# EAGLE design meca_2013.2 (EAGLE 6.4)
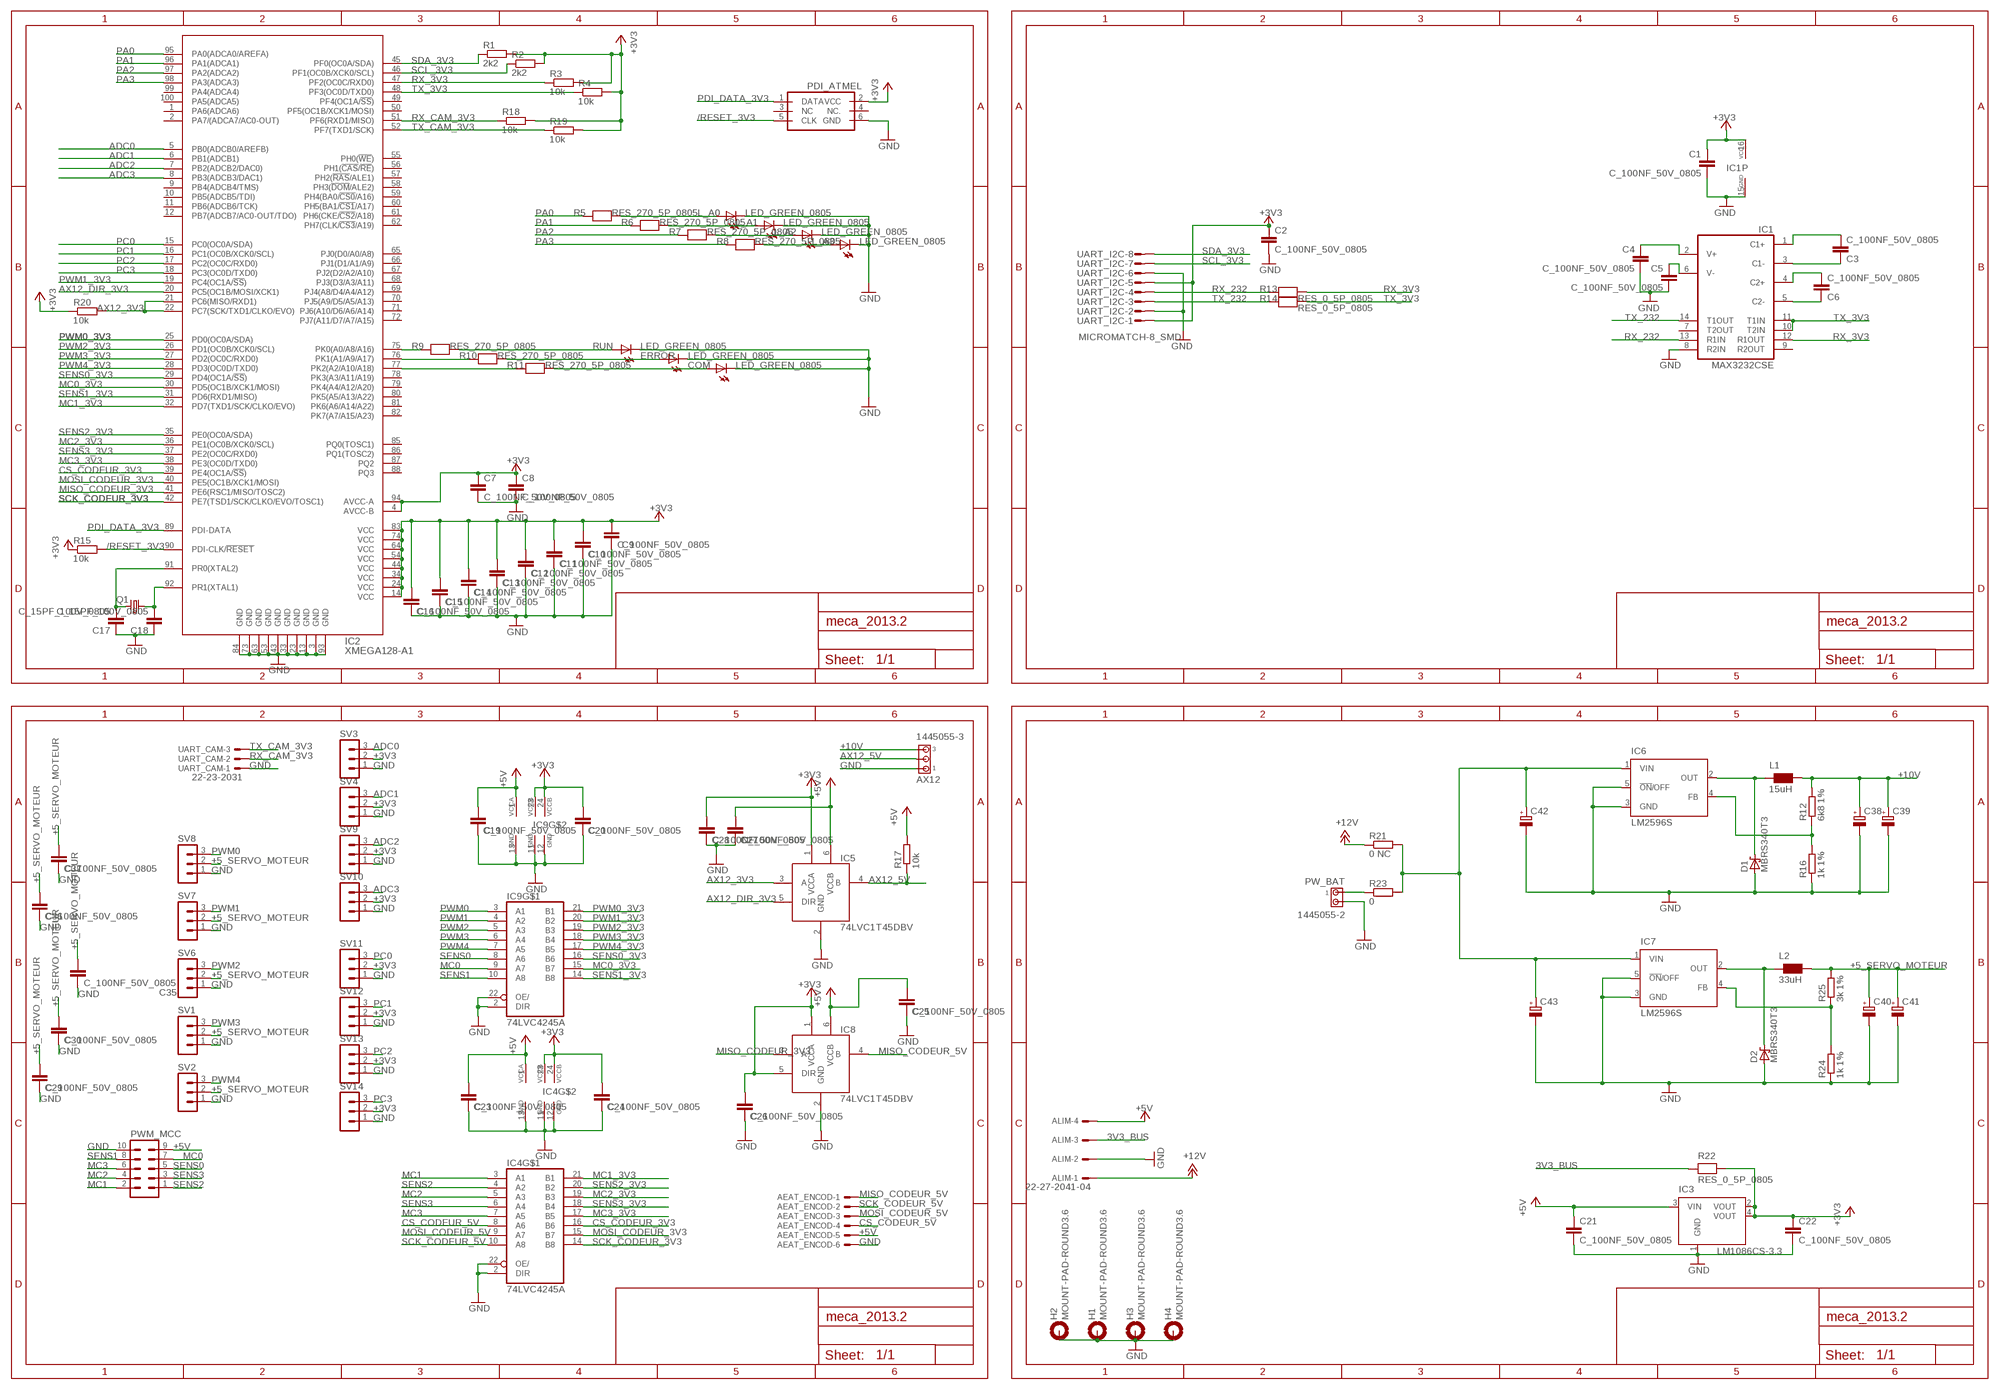
[diagram p0: schematic, sheet 1]

## Parts
AEAT_ENCOD  22-23-2061  [22-23-2061]
ALIM  22-27-2041-04  [6410-04]
AX12  1445055-3  [1445055-3]
C1  C_100NF_50V_0805  [C0805]
C2  C_100NF_50V_0805  [C0805]
C3  C_100NF_50V_0805  [C0805]
C4  C_100NF_50V_0805  [C0805]
C5  C_100NF_50V_0805  [C0805]
C6  C_100NF_50V_0805  [C0805]
C7  C_100NF_50V_0805  [C0805]
C8  C_100NF_50V_0805  [C0805]
C9  C_100NF_50V_0805  [C0805]
C10  C_100NF_50V_0805  [C0805]
C11  C_100NF_50V_0805  [C0805]
C12  C_100NF_50V_0805  [C0805]
C13  C_100NF_50V_0805  [C0805]
C14  C_100NF_50V_0805  [C0805]
C15  C_100NF_50V_0805  [C0805]
C16  C_100NF_50V_0805  [C0805]
C17  C_15PF_100V_0805  [C0805]
C18  C_15PF_100V_0805  [C0805]
C19  C_100NF_50V_0805  [C0805]
C20  C_100NF_50V_0805  [C0805]
C21  C_100NF_50V_0805  [C0805]
C22  C_100NF_50V_0805  [C0805]
C23  C_100NF_50V_0805  [C0805]
C24  C_100NF_50V_0805  [C0805]
C25  C_100NF_50V_0805  [C0805]
C26  C_100NF_50V_0805  [C0805]
C27  C_100NF_50V_0805  [C0805]
C28  C_100NF_50V_0805  [C0805]
C29  C_100NF_50V_0805  [C0805]
C30  C_100NF_50V_0805  [C0805]
C35  C_100NF_50V_0805  [C0805]
C36  C_100NF_50V_0805  [C0805]
C37  C_100NF_50V_0805  [C0805]
C38  CPOL-EUG  [PANASONIC_G]
C39  CPOL-EUG  [PANASONIC_G]
C40  CPOL-EUG  [PANASONIC_G]
C41  CPOL-EUG  [PANASONIC_G]
C42  CPOL-EUG  [PANASONIC_G]
C43  CPOL-EUG  [PANASONIC_G]
COM  LED_GREEN_0805  [CHIP-LED0805]
D1  MBRS340T3  [SMC]
D2  MBRS340T3  [SMC]
ERROR  LED_GREEN_0805  [CHIP-LED0805]
H1  MOUNT-PAD-ROUND3.6  [3,6-PAD]
H2  MOUNT-PAD-ROUND3.6  [3,6-PAD]
H3  MOUNT-PAD-ROUND3.6  [3,6-PAD]
H4  MOUNT-PAD-ROUND3.6  [3,6-PAD]
IC1  MAX3232CSE  [SO16]
IC2  XMEGA128-A1  XMEGA-A1TQFP  [TQFP100]
IC3  LM1086CS-3.3  [TO263]
IC4  74LVC4245A  [TSSOP28]
IC5  74LVC1T45DBV  [SOT23-6]
IC6  LM2596S  [TO263-5]
IC7  LM2596S  [TO263-5]
IC8  74LVC1T45DBV  [SOT23-6]
IC9  74LVC4245A  [TSSOP28]
L1  15uH  WE-PD_L/XL/XXL  [WE-PD_L/XL/XXL]
L2  33uH  WE-PD_L/XL/XXL  [WE-PD_L/XL/XXL]
L_A0  LED_GREEN_0805  [CHIP-LED0805]
L_A1  LED_GREEN_0805  [CHIP-LED0805]
L_A2  LED_GREEN_0805  [CHIP-LED0805]
L_A3  LED_GREEN_0805  [CHIP-LED0805]
PDI_ATMEL  PDI_ATMEL  [ML6]
PW_BAT  1445055-2  [1445055-2]
PWM_MCC  ML10  [ML10]
Q1  CRYSTAL_16MHZ_HC49UP  [HC49UP]
R1  2k2  R-EU_R0603  [R0603]
R2  2k2  R-EU_R0603  [R0603]
R3  10k  R-EU_R0603  [R0603]
R4  10k  R-EU_R0603  [R0603]
R5  RES_270_5P_0805  [R0805]
R6  RES_270_5P_0805  [R0805]
R7  RES_270_5P_0805  [R0805]
R8  RES_270_5P_0805  [R0805]
R9  RES_270_5P_0805  [R0805]
R10  RES_270_5P_0805  [R0805]
R11  RES_270_5P_0805  [R0805]
R12  6k8 1%  R-EU_R0805  [R0805]
R13  RES_0_5P_0805  [R0805]
R14  RES_0_5P_0805  [R0805]
R15  10k  R-EU_R0603  [R0603]
R16  1k 1%  R-EU_R0805  [R0805]
R17  10k  R-EU_R0805  [R0805]
R18  10k  R-EU_R0603  [R0603]
R19  10k  R-EU_R0603  [R0603]
R20  10k  R-EU_R0603  [R0603]
R21  0 NC  R-EU_R0805  [R0805]
R22  RES_0_5P_0805  [R0805]
R23  0  R-EU_R0805  [R0805]
R24  1k 1%  R-EU_R0805  [R0805]
R25  3k 1%  R-EU_R0805  [R0805]
RUN  LED_GREEN_0805  [CHIP-LED0805]
SV1  MA03-1  [MA03-1]
SV2  MA03-1  [MA03-1]
SV3  MA03-1  [MA03-1]
SV4  MA03-1  [MA03-1]
SV6  MA03-1  [MA03-1]
SV7  MA03-1  [MA03-1]
SV8  MA03-1  [MA03-1]
SV9  MA03-1  [MA03-1]
SV10  MA03-1  [MA03-1]
SV11  MA03-1  [MA03-1]
SV12  MA03-1  [MA03-1]
SV13  MA03-1  [MA03-1]
SV14  MA03-1  [MA03-1]
UART_CAM  22-23-2031  [22-23-2031]
UART_I2C  MICROMATCH-8_SMD  [MICROMATCH-8_SMD]

## Nets
3V3_BUS: ALIM.3 R22.1
+3V3: C1.1 C2.1 C7.1 C8.1 C9.1 C10.1 C11.1 C12.1 C13.1 C14.1 C15.1 C16.1 C20.1 C22.1 C24.1 C26.1 C28.1 IC1.16(VCC) IC2.4(AVCC-B) IC2.14(VCC) IC2.24(VCC) IC2.34(VCC) IC2.44(VCC) IC2.54(VCC) IC2.64(VCC) IC2.74(VCC) IC2.83(VCC) IC2.94(AVCC-A) IC3.2(VOUT) IC3.4(VOUT) IC4.23(VCCB) IC4.24(VCCB) IC5.1(VCCA) IC8.1(VCCA) IC8.5(DIR) IC9.23(VCCB) IC9.24(VCCB) PDI_ATMEL.2(VCC) R1.2 R2.2 R3.2 R4.2 R15.1 R18.2 R19.2 R20.1 R22.2 SV3.2 SV4.2 SV9.2 SV10.2 SV11.2 SV12.2 SV13.2 SV14.2 UART_I2C.1 UART_I2C.5
+5_SERVO_MOTEUR: C29.1 C30.1 C35.1 C36.1 C37.1 C40.+ C41.+ L2.1 R25.2 SV1.2 SV2.2 SV6.2 SV7.2 SV8.2
+5V: AEAT_ENCOD.5 ALIM.4 C19.1 C21.1 C23.1 C25.1 C27.1 IC3.3(VIN) IC4.1(VCCA) IC5.6(VCCB) IC8.6(VCCB) IC9.1(VCCA) PWM_MCC.9 R17.2
+10V: AX12.3 C38.+ C39.+ L1.1 R12.2
+12V: ALIM.1 R21.1
/RESET_3V3: IC2.90(PDI-CLK/!RESET) PDI_ATMEL.5(CLK) R15.2
ADC0: IC2.5(PB0(ADCB0/AREFB)) SV3.3
ADC1: IC2.6(PB1(ADCB1)) SV4.3
ADC2: IC2.7(PB2(ADCB2/DAC0)) SV9.3
ADC3: IC2.8(PB3(ADCB3/DAC1)) SV10.3
AX12_3V3: IC2.21(PC6(MISO/RXD1)) IC2.22(PC7(SCK/TXD1/CLKO/EVO)) IC5.3(A) R20.2
AX12_5V: AX12.2 IC5.4(B) R17.1
AX12_DIR_3V3: IC2.20(PC5(OC1B/MOSI/XCK1)) IC5.5(DIR)
CS_CODEUR_3V3: IC2.39(PE4(OC1A/!SS!)) IC4.16(B6)
CS_CODEUR_5V: AEAT_ENCOD.4 IC4.8(A6)
GND: AEAT_ENCOD.6 ALIM.2 AX12.1 C1.2 C2.2 C4.2 C5.2 C7.2 C8.2 C9.2 C10.2 C11.2 C12.2 C13.2 C14.2 C15.2 C16.2 C17.1 C18.1 C19.2 C20.2 C21.2 C22.2 C23.2 C24.2 C25.2 C26.2 C27.2 C28.2 C29.2 C30.2 C35.2 C36.2 C37.2 C38.- C39.- C40.- C41.- C42.- C43.- COM.C D1.A D2.A ERROR.C H1.B3,6(MOUNT) H2.B3,6(MOUNT) H3.B3,6(MOUNT) H4.B3,6(MOUNT) IC1.8(R2IN) IC1.15(GND) IC2.3(GND) IC2.13(GND) IC2.23(GND) IC2.33(GND) IC2.43(GND) IC2.53(GND) IC2.63(GND) IC2.73(GND) IC2.84(GND) IC2.93(GND) IC3.1(GND) IC4.2(DIR) IC4.11(GND) IC4.12(GND) IC4.13(GND) IC4.22(OE/) IC5.2(GND) IC6.3(GND) IC6.5(!ON!/OFF) IC7.3(GND) IC7.5(!ON!/OFF) IC8.2(GND) IC9.2(DIR) IC9.11(GND) IC9.12(GND) IC9.13(GND) IC9.22(OE/) L_A0.C L_A1.C L_A2.C L_A3.C PDI_ATMEL.6(GND) PW_BAT.2 PWM_MCC.10 R16.1 R24.1 RUN.C SV1.1 SV2.1 SV3.1 SV4.1 SV6.1 SV7.1 SV8.1 SV9.1 SV10.1 SV11.1 SV12.1 SV13.1 SV14.1 UART_CAM.1 UART_I2C.2 UART_I2C.6
MC0: IC9.9(A7) PWM_MCC.7
MC0_3V3: IC2.30(PD5(OC1B/XCK1/MOSI)) IC9.15(B7)
MC1: IC4.3(A1) PWM_MCC.2
MC1_3V3: IC2.32(PD7(TXD1/SCK/CLKO/EVO)) IC4.21(B1)
MC2: IC4.5(A3) PWM_MCC.4
MC2_3V3: IC2.36(PE1(OC0B/XCK0/SCL)) IC4.19(B3)
MC3: IC4.7(A5) PWM_MCC.6
MC3_3V3: IC2.38(PE3(OC0D/TXD0)) IC4.17(B5)
MISO_CODEUR_3V3: IC2.41(PE6(RSC1/MISO/TOSC2)) IC8.3(A)
MISO_CODEUR_5V: AEAT_ENCOD.1 IC8.4(B)
MOSI_CODEUR_3V3: IC2.40(PE5(OC1B/XCK1/MOSI)) IC4.15(B7)
MOSI_CODEUR_5V: AEAT_ENCOD.3 IC4.9(A7)
N$1: C3.1 IC1.1(C1+)
N$2: R9.2 RUN.A
N$3: IC7.4(FB) R24.2 R25.1
N$4: ERROR.A R10.2
N$5: C3.2 IC1.3(C1-)
N$6: C6.1 IC1.4(C2+)
N$7: COM.A R11.2
N$8: IC6.4(FB) R12.1 R16.2
N$9: IC2.75(PK0(A0/A8/A16)) R9.1
N$10: IC2.76(PK1(A1/A9/A17)) R10.1
N$11: C4.1 IC1.2(V+)
N$12: IC2.77(PK2(A2/A10/A18)) R11.1
N$13: C5.1 IC1.6(V-)
N$15: PW_BAT.1 R23.1
N$16: D1.C IC6.2(OUT) L1.2
N$17: D2.C IC7.2(OUT) L2.2
N$24: C6.2 IC1.5(C2-)
N$45: C17.2 IC2.91(PR0(XTAL2)) Q1.2
N$46: C18.2 IC2.92(PR1(XTAL1)) Q1.1
N$91: L_A0.A R5.2
N$92: L_A1.A R6.2
N$93: L_A2.A R7.2
N$94: L_A3.A R8.2
PA0: IC2.95(PA0(ADCA0/AREFA)) R5.1
PA1: IC2.96(PA1(ADCA1)) R6.1
PA2: IC2.97(PA2(ADCA2)) R7.1
PA3: IC2.98(PA3(ADCA3)) R8.1
PC0: IC2.15(PC0(OC0A/SDA)) SV11.3
PC1: IC2.16(PC1(OC0B/XCK0/SCL)) SV12.3
PC2: IC2.17(PC2(OC0C/RXD0)) SV13.3
PC3: IC2.18(PC3(OC0D/TXD0)) SV14.3
PDI_DATA_3V3: IC2.89(PDI-DATA) PDI_ATMEL.1(DATA)
PW: C42.+ C43.+ IC6.1(VIN) IC7.1(VIN) R21.2 R23.2
PWM0: IC9.3(A1) SV8.3
PWM0_3V3: IC2.25(PD0(OC0A/SDA)) IC9.21(B1)
PWM1: IC9.4(A2) SV7.3
PWM1_3V3: IC2.19(PC4(OC1A/!SS!)) IC9.20(B2)
PWM2: IC9.5(A3) SV6.3
PWM2_3V3: IC2.26(PD1(OC0B/XCK0/SCL)) IC9.19(B3)
PWM3: IC9.6(A4) SV1.3
PWM3_3V3: IC2.27(PD2(OC0C/RXD0)) IC9.18(B4)
PWM4: IC9.7(A5) SV2.3
PWM4_3V3: IC2.28(PD3(OC0D/TXD0)) IC9.17(B5)
RX_3V3: IC1.12(R1OUT) IC2.47(PF2(OC0C/RXD0)) R3.1 R13.2
RX_232: IC1.13(R1IN) R13.1 UART_I2C.4
RX_CAM_3V3: IC2.51(PF6(RXD1/MISO)) R18.1 UART_CAM.2
SCK_CODEUR_3V3: IC2.42(PE7(TSD1/SCK/CLKO/EVO/TOSC1)) IC4.14(B8)
SCK_CODEUR_5V: AEAT_ENCOD.2 IC4.10(A8)
SCL_3V3: IC2.46(PF1(OC0B/XCK0/SCL)) R2.1 UART_I2C.7
SDA_3V3: IC2.45(PF0(OC0A/SDA)) R1.1 UART_I2C.8
SENS0: IC9.8(A6) PWM_MCC.5
SENS0_3V3: IC2.29(PD4(OC1A/!SS!)) IC9.16(B6)
SENS1: IC9.10(A8) PWM_MCC.8
SENS1_3V3: IC2.31(PD6(RXD1/MISO)) IC9.14(B8)
SENS2: IC4.4(A2) PWM_MCC.1
SENS2_3V3: IC2.35(PE0(OC0A/SDA)) IC4.20(B2)
SENS3: IC4.6(A4) PWM_MCC.3
SENS3_3V3: IC2.37(PE2(OC0C/RXD0)) IC4.18(B4)
TX_3V3: IC1.10(T2IN) IC1.11(T1IN) IC2.48(PF3(OC0D/TXD0)) R4.1 R14.2
TX_232: IC1.14(T1OUT) R14.1 UART_I2C.3
TX_CAM_3V3: IC2.52(PF7(TXD1/SCK)) R19.1 UART_CAM.3
Unconnected: IC1.7(T2OUT) IC1.9(R2OUT) IC2.1(PA6(ADCA6)) IC2.2(PA7/(ADCA7/AC0-OUT)) IC2.9(PB4(ADCB4/TMS)) IC2.10(PB5(ADCB5/TDI)) IC2.11(PB6(ADCB6/TCK)) IC2.12(PB7(ADCB7/AC0-OUT/TDO)) IC2.49(PF4(OC1A/!SS!)) IC2.50(PF5(OC1B/XCK1/MOSI)) IC2.55(PH0(!WE!)) IC2.56(PH1(!CAS!/!RE!)) IC2.57(PH2(!RAS!/ALE1)) IC2.58(PH3(!DOM!/ALE2)) IC2.59(PH4(BA0/!CS0!/A16)) IC2.60(PH5(BA1/!CS1!/A17)) IC2.61(PH6(CKE/!CS2!/A18)) IC2.62(PH7(CLK/!CS3!/A19)) IC2.65(PJ0(D0/A0/A8)) IC2.66(PJ1(D1/A1/A9)) IC2.67(PJ2(D2/A2/A10)) IC2.68(PJ3(D3/A3/A11)) IC2.69(PJ4(A8/D4/A4/A12)) IC2.70(PJ5(A9/D5/A5/A13)) IC2.71(PJ6(A10/D6/A6/A14)) IC2.72(PJ7(A11/D7/A7/A15)) IC2.78(PK3(A3/A11/A19)) IC2.79(PK4(A4/A12/A20)) IC2.80(PK5(A5/A13/A22)) IC2.81(PK6(A6/A14/A22)) IC2.82(PK7(A7/A15/A23)) IC2.85(PQ0(TOSC1)) IC2.86(PQ1(TOSC2)) IC2.87(PQ2) IC2.88(PQ3) IC2.99(PA4(ADCA4)) IC2.100(PA5(ADCA5)) PDI_ATMEL.3(NC) PDI_ATMEL.4(NC.)

## Library data of the parts
AEAT_ENCOD = con-molex:22-23-2061: .100" (2.54mm) Center Header - 6 Pin; MF: MOLEX; MPN: 22-23-2061; OC_FARNELL: 1462922; OC_NEWARK: 27C1933
ALIM = con-molex:22-?-04: CONNECTOR wire to board 2.54 mm (.1 inch) pitch header; OC_FARNELL: unknown; OC_NEWARK: unknown
AX12 = con-amp:1445055-3: Micro MATE-N-LOK Connectors grid 1.5 mm Source: ENG_CD_1445055_A.pdf
C1-C30 C35-C37 = robotter_capacitor:C_
C38-C43 = rcl:CPOL-EU: POLARIZED CAPACITOR, European symbol
COM ERROR L_A0 L_A1-L_A3 RUN = robotter_diode:LED_
D1 D2 = diode:MBRS3*0T3: SCHOTTKY BARRIER RECTIFIER 3.0 AMPERES 20, 30, 40 VOLT Source: MBRS340T3-D.pdf
H1-H4 = holes:MOUNT-PAD-ROUND: MOUNTING PAD, round
IC1 = robotter_ic:MAX3232: True RS-232 Transceivers 3.0V to 5.5V, Low-Power up to 1Mbps, Using Four 0.1µF External Capacitors Source: http://pdfserv.maxim-ic.com/en/ds/MAX3222-MAX3241.pdf
IC2 = avr-7:XMEGA-A1: Atmel XMega A1 Series processor
IC3 = robotter_ic:LM1086CS-3.3
IC4 IC9 = yohan_robotter:74LVC4245A
IC5 IC8 = yohan_robotter:74LVC1T45DBV
IC6 IC7 = national-semiconductor:LM2596: SIMPLE SWITCHER® Power Converter 150 kHz 3A Step-Down Voltage Regulator Source: http://www.national.com/ds/LM/LM2596.pdf; MF: NATIONAL SEMICONDUCTOR; MPN: LM2596S-ADJ/NOPB; OC_FARNELL: 9494367; OC_NEWARK: 41K3842
L1 L2 = wurth_electronics_midcom_inc_v1-0:WE-PD: SMD-Shielded Power Inductors WE-PD Is recommended for the application with switching regulators with low operating voltages (computer, laptop, mobile phones, pagers) - Magnetically shielded version which results in a low leakage field - High storage capacity - Low self-losses -- Integrated DC/DC-converter Website: Wurth Electronics <http://www.we-online.com> Contact us Wurth Electronics Midcom, Inc. 121 Airport Dr. Watertown, SD 57201 Phone: (605) 886-4385 Fax: (605) 886-4486 E-Mail: midcom@we-online.com
PDI_ATMEL = robotter_connector:PDI_ATMEL: Ref Harting : 09 18 506 7323 Atmel pdi connector
PW_BAT = con-amp:1445055-2: Micro MATE-N-LOK Connectors grid 1.5 mm Source: ENG_CD_1445055_A.pdf
PWM_MCC = con-harting-ml:ML10: HARTING; OC_FARNELL: unknown; OC_NEWARK: unknown
Q1 = robotter_ic:CRYSTAL_: CRYSTAL
R1-R4 R15 R18-R21 R23-R25 = rcl:R-EU_: RESISTOR, European symbol
R5-R11 R13 R14 R22 = robotter_resistor:RES_
R12 R16 R17 = resistor:R-EU_: RESISTOR, European symbol
SV1-SV4 SV6-SV14 = con-lstb:MA03-1: PIN HEADER; OC_FARNELL: unknown; OC_NEWARK: unknown
UART_CAM = con-molex:22-23-2031: .100" (2.54mm) Center Header - 3 Pin; MF: MOLEX; MPN: 22-23-2031; OC_FARNELL: 1462950; OC_NEWARK: 30C0862
UART_I2C = robotter_connector:MICROMATCH-8_SMD: Ref FN : 1865096

## Board
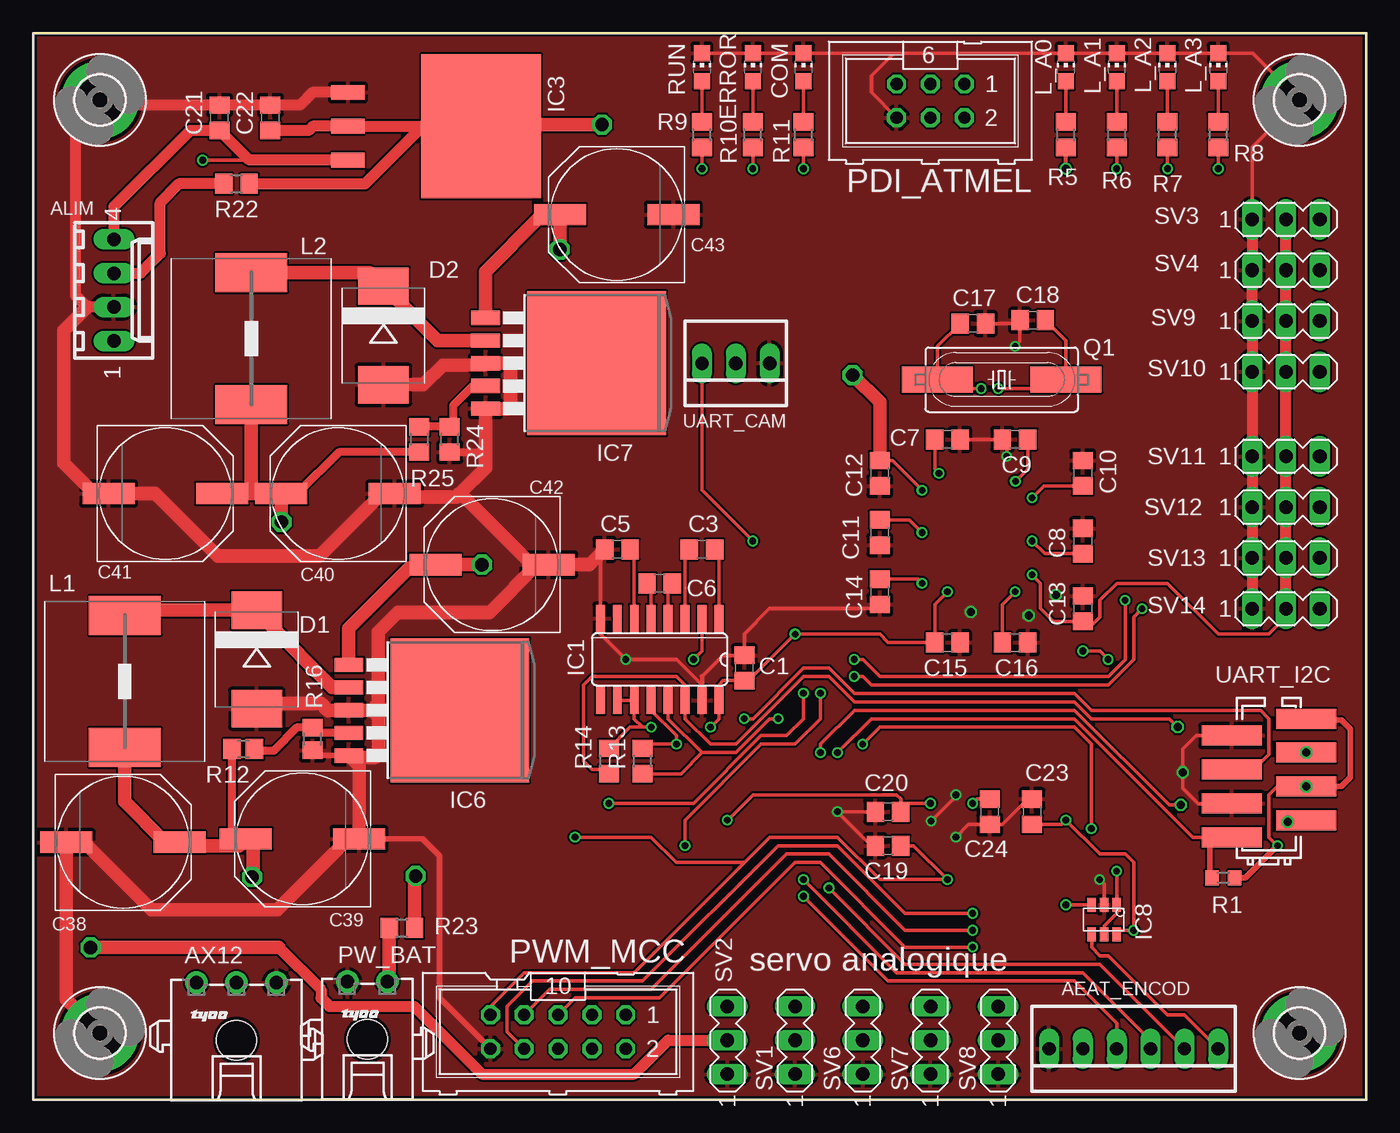
[diagram p1: board, top side]
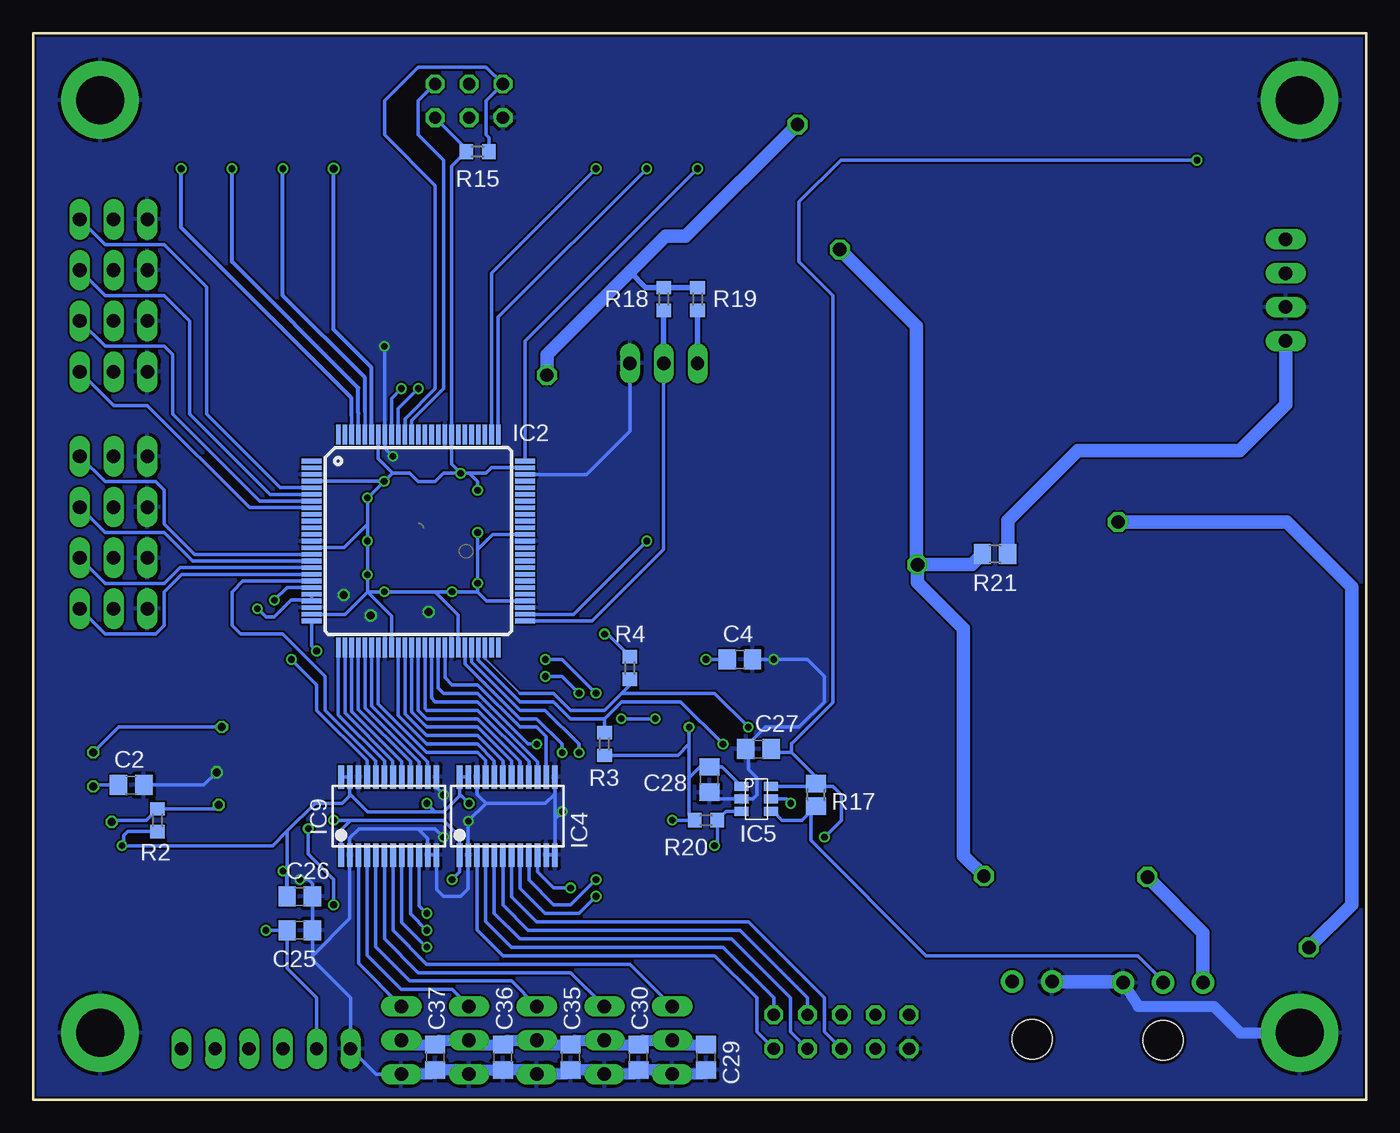
[diagram p2: board, bottom side, seen from below]

Size 100 x 80 mm. Coordinates in mm from the lower left corner, seen from the top.
Outline: 100,0 0,0 0,80 100,80 100,0
Copper layers (1*16): Top 0.035mm / dielectric 1.5mm / Bottom 0.035mm
Design rules "default": minimum track width 6mil, minimum drill 12mil, track to track 6mil, track to pad 6mil, pad to pad 6mil, via to via 6mil, smd to smd 0mil, copper to edge 10mil, drill to drill 10mil, minimum pad ring 10mil, minimum via ring 6mil, stop-mask expansion 2mil, vias tented up to drill 100mil, thermal gap 10mil

### Footprints (pad centres in the part's own frame; a part is rotated, then mirrored left to right if it is on the bottom)
22-23-2061 = drill 1 long: 1 -6.35,0; 2 -3.81,0; 3 -1.27,0; 4 1.27,0; 5 3.81,0; 6 6.35,0
6410-04 = drill 1.016 long: 1 3.81,0; 2 1.27,0; 3 -1.27,0; 4 -3.81,0
1445055-3 = drill 1 pad 1.676: 1 3,4.32; 2 0,4.32; 3 -3,4.32 | hole 3: 0,0
C0805 = smd 1.3 x 1.5: 1 -0.95,0; 2 0.95,0
PANASONIC_G = smd 3.9 x 1.6: + 4.25,0; - -4.25,0
CHIP-LED0805 = smd 1.2 x 1.2: A 0,-1.05; C 0,1.05
SMC = smd 2.8 x 3.8: A 3.7,0; C -3.7,0
3,6-PAD = drill 3.6 pad 5.842: B3,6 0,0
SO16 = smd 0.66 x 2.032: 1 -4.445,-3.073; 2 -3.175,-3.073; 3 -1.905,-3.073; 4 -0.635,-3.073; 5 0.635,-3.073; 6 1.905,-3.073; 7 3.175,-3.073; 8 4.445,-3.073; 9 4.445,3.073; 10 3.175,3.073; 11 1.905,3.073; 12 0.635,3.073; 13 -0.635,3.073; 14 -1.905,3.073; 15 -3.175,3.073; 16 -4.445,3.073
TQFP100 = smd 1.5 x 0.347: 1 -8,6; 2 -8,5.5; 3 -8,5; 4 -8,4.5; 5 -8,4; 6 -8,3.5; 7 -8,3; 8 -8,2.5; 9 -8,2; 10 -8,1.5; 11 -8,1; 12 -8,0.5; 13 -8,0; 14 -8,-0.5; 15 -8,-1; 16 -8,-1.5; 17 -8,-2; 18 -8,-2.5; 19 -8,-3; 20 -8,-3.5; 21 -8,-4; 22 -8,-4.5; 23 -8,-5; 24 -8,-5.5; 25 -8,-6; 51 8,-6; 52 8,-5.5; 53 8,-5; 54 8,-4.5; 55 8,-4; 56 8,-3.5; 57 8,-3; 58 8,-2.5; 59 8,-2; 60 8,-1.5; 61 8,-1; 62 8,-0.5; 63 8,0; 64 8,0.5; 65 8,1; 66 8,1.5; 67 8,2; 68 8,2.5; 69 8,3; 70 8,3.5; 71 8,4; 72 8,4.5; 73 8,5; 74 8,5.5; 75 8,6 | smd 0.347 x 1.5: 26 -6,-8; 27 -5.5,-8; 28 -5,-8; 29 -4.5,-8; 30 -4,-8; 31 -3.5,-8; 32 -3,-8; 33 -2.5,-8; 34 -2,-8; 35 -1.5,-8; 36 -1,-8; 37 -0.5,-8; 38 0,-8; 39 0.5,-8; 40 1,-8; 41 1.5,-8; 42 2,-8; 43 2.5,-8; 44 3,-8; 45 3.5,-8; 46 4,-8; 47 4.5,-8; 48 5,-8; 49 5.5,-8; 50 6,-8; 76 6,8; 77 5.5,8; 78 5,8; 79 4.5,8; 80 4,8; 81 3.5,8; 82 3,8; 83 2.5,8; 84 2,8; 85 1.5,8; 86 1,8; 87 0.5,8; 88 0,8; 89 -0.5,8; 90 -1,8; 91 -1.5,8; 92 -2,8; 93 -2.5,8; 94 -3,8; 95 -3.5,8; 96 -4,8; 97 -4.5,8; 98 -5,8; 99 -5.5,8; 100 -6,8
TO263 = smd 1.1 x 2.5: 1 -2.54,-8.15; 2 0,-8.15; 3 2.54,-8.15 | smd 10.8 x 9: 4 0,1.85
TSSOP28 = smd 0.42 x 1.778: 1 -3.25,-3.25; 2 -2.6,-3.25; 3 -1.95,-3.25; 4 -1.3,-3.25; 5 -0.65,-3.25; 6 0,-3.25; 7 0.65,-3.25; 8 1.3,-3.25; 9 1.95,-3.25; 10 2.6,-3.25; 11 3.25,-3.25; 12 3.9,-3.25; 13 3.9,2.6; 14 3.25,2.6; 15 2.6,2.6; 16 1.95,2.6; 17 1.3,2.6; 18 0.65,2.6; 19 0,2.6; 20 -0.65,2.6; 21 -1.3,2.6; 22 -1.95,2.6; 23 -2.6,2.6; 24 -3.25,2.6
SOT23-6 = smd 0.66 x 1.067: 1 0,0; 2 0.94,0; 3 1.88,0; 4 1.88,2.21; 5 0.94,2.21; 6 0,2.21
TO263-5 = smd 1.067 x 2.159: 1 -3.404,-5.791; 2 -1.702,-5.791; 3 0,-5.791; 4 1.702,-5.791; 5 3.404,-5.791 | smd 10.8 x 10.41: 6 0,2.54
WE-PD_L/XL/XXL = smd 2.9 x 5.4: 1 -4.95,0; 2 4.95,0
ML6 = drill 0.914 octagon: 1 -2.54,-1.27; 2 -2.54,1.27; 3 0,-1.27; 4 0,1.27; 5 2.54,-1.27; 6 2.54,1.27
1445055-2 = drill 1 pad 1.676: 1 1.5,4.32; 2 -1.5,4.32 | hole 3: 0,0
ML10 = drill 0.914 octagon: 1 -5.08,-1.27; 2 -5.08,1.27; 3 -2.54,-1.27; 4 -2.54,1.27; 5 0,-1.27; 6 0,1.27; 7 2.54,-1.27; 8 2.54,1.27; 9 5.08,-1.27; 10 5.08,1.27
HC49UP = smd 5.334 x 1.93: 1 -4.826,0; 2 4.826,0
R0603 = smd 1 x 1.1: 1 -0.85,0; 2 0.85,0
R0805 = smd 1.3 x 1.5: 1 -0.95,0; 2 0.95,0
R0805' = smd 1.3 x 1.5: 1 -0.85,0; 2 0.85,0
MA03-1 = drill 1.016 long: 1 -2.54,0; 2 0,0; 3 2.54,0
22-23-2031 = drill 1 long: 1 -2.54,0; 2 0,0; 3 2.54,0
MICROMATCH-8_SMD = smd 1.5 x 4.5: 1 4.445,-2.794; 2 3.175,2.794; 3 1.905,-2.794; 4 0.635,2.794; 5 -0.635,-2.794; 6 -1.905,2.794; 7 -3.175,-2.794; 8 -4.445,2.794

### Placement (x,y rotation side)
AEAT_ENCOD  82.55,3.81 180 top
ALIM  6.04,60.73 270 top
AX12  15.24,4.45 0 top
C1  53.34,32.38 90 top
C2  92.66,23.6 0 bottom
C3  50.16,41.27 180 top
C4  46.99,33.02 0 bottom
C5  43.81,41.27 180 top
C6  46.99,38.73 180 top
C7  68.58,49.53 0 top
C8  78.74,41.91 90 top
C9  73.66,49.53 180 top
C10  78.74,46.99 90 top
C11  63.5,42.55 270 top
C12  63.5,46.99 270 top
C13  78.74,36.83 90 top
C14  63.5,38.1 270 top
C15  68.58,34.29 0 top
C16  73.66,34.29 0 top
C17  70.49,58.23 180 top
C18  74.99,58.47 0 top
C19  64.14,19.05 180 top
C20  64.14,21.59 180 top
C21  13.97,73.66 90 top
C22  17.78,73.66 90 top
C23  74.93,21.59 90 top
C24  71.75,21.59 270 top
C25  80.01,12.7 0 bottom
C26  80.01,15.24 0 bottom
C27  45.59,26.29 180 bottom
C28  49.28,24 270 bottom
C29  49.53,3.17 270 bottom
C30  54.61,3.17 270 bottom
C35  59.69,3.17 270 bottom
C36  64.77,3.17 270 bottom
C37  69.85,3.17 270 bottom
C38  6.73,19.3 0 top
C39  20.19,19.56 180 top
C40  22.86,45.47 180 top
C41  9.91,45.47 0 top
C42  34.42,40.13 180 top
C43  43.76,66.4 180 top
COM  57.78,77.47 0 top
D1  16.76,33.02 270 top
D2  26.26,57.33 270 top
ERROR  53.98,77.47 0 top
H1  95,5 0 top
H2  5,75 0 top
H3  95,75 0 top
H4  5,5 0 top
IC1  46.99,33.02 180 top
IC2  71.12,41.91 0 bottom
IC3  31.75,73.03 270 top
IC4  64.77,21.59 0 bottom
IC5  46.86,23.5 270 bottom
IC6  29.46,29.21 270 top
IC7  39.73,55.24 270 top
IC8  81.28,14.61 180 top
IC9  73.66,21.59 0 bottom
L1  6.86,31.37 90 top
L2  16.36,57.1 90 top
L_A0  77.47,77.47 0 top
L_A1  81.28,77.47 0 top
L_A2  85.09,77.47 0 top
L_A3  88.9,77.47 0 top
PDI_ATMEL  67.31,74.93 180 top
PW_BAT  25.07,4.52 0 top
PWM_MCC  39.37,5.08 180 top
Q1  72.65,54.01 180 top
R1  89.28,16.64 0 top
R2  90.68,20.95 270 bottom
R3  57.15,26.67 270 bottom
R4  55.24,32.38 90 bottom
R5  77.47,72.39 90 top
R6  81.28,72.39 90 top
R7  85.09,72.39 90 top
R8  88.9,72.39 90 top
R9  50.16,72.39 90 top
R10  53.98,72.39 90 top
R11  57.78,72.39 90 top
R12  6k8 1%  [R0805']  15.75,26.29 180 top
R13  45.72,25.4 90 top
R14  43.18,25.4 90 top
R15  66.67,71.12 0 bottom
R16  1k 1%  [R0805']  20.95,27.05 90 top
R17  10k  [R0805']  41.27,22.86 90 bottom
R18  52.7,60.07 90 bottom
R19  50.16,60.07 90 bottom
R20  49.53,20.95 0 bottom
R21  27.84,40.92 180 bottom
R22  15.24,68.71 0 top
R23  27.66,12.88 0 top
R24  31.24,49.53 90 top
R25  28.96,49.53 270 top
RUN  50.16,77.47 0 top
SV1  57.15,4.45 90 top
SV2  52.07,4.45 90 top
SV3  93.98,66.04 0 top
SV4  93.98,62.23 0 top
SV6  62.23,4.45 90 top
SV7  67.31,4.45 90 top
SV8  72.39,4.45 90 top
SV9  93.98,58.42 0 top
SV10  93.98,54.61 0 top
SV11  93.98,48.26 0 top
SV12  93.98,44.45 0 top
SV13  93.98,40.64 0 top
SV14  93.98,36.83 0 top
UART_CAM  52.7,55.24 180 top
UART_I2C  92.71,24.13 90 top

### Tracks (layer width: path | path; a pad name or v marks a point on that pad's centre or on a via)
3V3_BUS
  Top 0.813: ALIM.3 8.03,62 9.53,63.5 9.53,67.31 10.92,68.71 R22.1
+3V3  (via drill 0.5, 0.6, 1)
  Top 0.254: C24.1 70.8,22.54 v70.48,22.23 | v67.31,22.23 65.72,22.23 C20.1 65.08,22.55 64.77,22.86 53.98,22.86 v52.07,20.95 | v81.28,17.14 IC8.1 81.28,13.97 80.34,13.03 IC8.5 | v50.8,27.94 51.44,28.57 IC1.16 51.44,31.11 51.76,31.43 C1.1 53.66,31.43 v57.15,34.92 63.5,34.92 64.14,34.29 C15.1 67.63,37.15 v68.58,38.1 | C11.1 65.72,43.49 v66.67,42.55 | C14.1 66.36,39.05 v66.67,38.73 | C16.1 72.71,37.15 v73.66,38.1 | v74.93,39.37 75.56,38.73 75.56,36.83 76.52,35.88 C13.1 79.06,35.56 79.38,35.56 80.01,36.2 80.01,37.47 81.28,38.73 85.09,38.73 88.9,34.92 92.71,34.92 93.98,36.2 SV14.2 | C8.1 75.88,40.96 v74.93,41.91 | C10.1 75.83,46.04 v74.93,45.14 | C9.1 74.61,47.3 v73.69,46.38 | C7.1 67.63,47.3 v67.94,46.99 | v66.67,45.72 64.45,47.94 C12.1 63.5,48.51 63.5,52.7 | v95.5,23.5 93.34,23.5 92.71,22.86 92.71,19.68 v93.34,19.05
  Top 0.406: v95.5,23.5 98.12,23.5 98.81,24.18 98.81,27.81 98.12,28.5 95.58,28.5 UART_I2C.1 | R1.2 90.93,16.64 v93.34,19.05
  Top 0.813: C22.1 20.64,72.71 20.95,73.03 IC3.2 29.21,73.03 | 29.21,73.03 IC3.4 | R22.2 24.89,68.71 29.21,73.03 | SV14.2 SV13.2 SV12.2 SV11.2 SV10.2 SV9.2 SV4.2 SV3.2
  Top 1.016: IC3.4 33.73,73.15 v42.67,73.15 | v61.47,54.36 63.5,52.32 63.5,48.51
  Bottom 0.254: IC5.1 48.32,24.95 C28.1 49.98,24.95 50.8,24.13 | 50.8,24.13 50.8,21.38 R20.1 v52.07,20.95 | IC4.23 IC4.24 68.02,22.79 | 68.02,22.79 69.22,21.59 69.85,21.59 | 69.85,21.59 74.93,21.59 76.26,22.92 | 76.26,22.92 IC9.23 IC9.24 | v70.48,22.23 69.85,21.59 | v67.31,22.23 67.87,22.79 68.02,22.79 | 80.96,16.82 v81.28,17.14 | C26.1 80.96,20.14 | v50.8,27.94 50.8,26.67 | 50.8,26.67 50.8,24.13 | IC2.74 65.62,47.41 66.04,46.99 67.31,46.99 | v67.94,46.99 68.62,47.66 IC2.83 68.62,70.03 R15.1 67.53,71.33 PDI_ATMEL.2 | v67.94,46.99 67.31,46.99 | IC2.94 74.12,48.09 73.03,46.99 | 73.03,46.99 71.75,46.99 71.12,46.35 69.85,46.35 69.22,46.99 v67.94,46.99 | IC2.4 73.66,46.41 | 73.66,46.41 73.61,46.41 73.03,46.99 | IC2.14 76.7,41.41 74.93,43.18 | 73.66,46.41 v73.69,46.38 v74.93,45.14 74.93,43.18 | IC2.24 76.62,36.41 74.93,38.1 | 74.93,38.1 v74.93,39.37 v74.93,41.91 74.93,43.18 | IC2.34 73.12,36.29 74.93,38.1 | IC2.44 68.12,36.37 69.85,38.1 | 69.85,38.1 v73.66,38.1 74.93,38.1 | IC2.54 65.98,37.41 66.67,38.1 | 66.67,38.1 v68.58,38.1 69.85,38.1 | IC2.64 65.54,42.41 66.67,41.27 | 66.67,41.27 v66.67,38.73 66.67,38.1 | v66.67,42.55 66.67,41.27 | v66.67,45.72 66.67,46.35 67.31,46.99 | 80.96,20.14 78.88,22.23 76.83,22.23 76.26,22.8 76.26,22.92 | R3.2 51.65,25.82 50.8,26.67 | 80.96,20.14 82.05,19.05 v93.34,19.05 93.22,19.18 93.22,19.81 92.92,20.11 R2.2 | v57.15,34.92 56.94,34.92 R4.2 | C2.1 95.4,23.6 v95.5,23.5
  Bottom 0.305: C26.1 80.96,16.82
  Bottom 0.406: 55.24,62.1 54.06,60.92 R18.2 R19.2
  Bottom 1.016: v42.67,73.15 51.05,64.77 52.58,64.77 55.24,62.1 61.47,55.88 v61.47,54.36
+5_SERVO_MOTEUR  (via drill 1)
  Top 0.61: R25.2 22.93,48.58 19.81,45.47 C40.+
  Top 0.813: SV2.2 47.62,4.45 45.09,1.91 33.66,1.91 28.57,6.99 22.23,6.99 21.59,7.62 21.59,8.26 18.41,11.43
  Top 1.016: C41.+ 17.02,45.47 | 17.02,45.47 C40.+ 18.61,43.34 v18.62,43.33 | L2.1 16.36,46.13 17.02,45.47 | v4.29,11.4 18.39,11.4 18.41,11.43
  Bottom 0.813: SV8.2 72.07,4.12 C37.1 69.53,4.45 SV7.2 66.99,4.12 C36.1 64.45,4.45 SV6.2 61.91,4.12 C35.1 59.37,4.45 SV1.2 56.83,4.12 C30.1 54.29,4.45 SV2.2 51.75,4.12 C29.1
  Bottom 1.016: v18.62,43.33 5.97,43.33 1.09,38.46 1.09,14.61 v4.29,11.4
+5V  (via drill 0.5)
  Top 0.254: PWM_MCC.9 34.29,6.99 36.83,9.53 45.09,9.53 53.34,17.78 | C23.1 77.16,20.64 v77.47,20.95 80.01,18.41 81.92,18.41 82.55,17.78 v82.55,12.7 81.58,12.7 IC8.6 | C19.1 66.04,19.05 v68.58,16.51 63.5,16.51 60.33,19.68 55.24,19.68 53.34,17.78 | v12.7,70.48 16.51,70.48 | v40.64,19.68 46.35,19.68 48.26,17.78 53.34,17.78
  Top 0.813: IC3.3 16.51,70.48 16.2,70.48 C21.1 11.75,72.71 6.04,67 ALIM.4
  Bottom 0.254: 41.27,24.19 43.12,26.04 | 43.12,26.04 44.45,26.04 | IC5.6 41.49,23.5 | 43.12,26.04 43.12,26.67 | 43.12,26.67 43.12,26.73 | 43.12,26.67 40.01,29.78 40.01,60.33 42.55,62.87 42.55,67.36 39.42,70.48 v12.7,70.48 | IC9.1 76.91,20.25 76.2,20.95 | 76.2,20.95 69.22,20.95 68.02,19.76 IC4.1 68.02,17.07 v68.58,16.51 | v77.47,20.95 76.2,20.95 | AEAT_ENCOD.5 78.74,7.62 80.96,9.84 C25.1 v82.55,12.7 | v40.64,19.68 39.37,20.95 39.37,22.86 40.01,23.5 41.06,23.5 R17.2
  Bottom 0.406: 41.27,24.19 R17.2 41.49,23.5 | 44.45,26.04 C27.1
+10V  (via drill 1)
  Top 0.61: R12.2 14.9,19.84 C39.+
  Top 1.016: L1.1 6.86,22.35 9.91,19.3 C38.+ 11.23,19.05 15.44,19.05 C39.+ 16.48,19.02 16.48,16.76 v16.41,16.69
  Bottom 1.016: AX12.3 12.24,12.52 v16.41,16.69
+12V
  Bottom 1.016: ALIM.1 6.04,52.15 9.5,48.69 21.64,48.69 26.89,43.44 R21.1
/RESET_3V3
  Bottom 0.254: IC2.90 72.12,51.07 69.85,53.34 69.85,68.58 73.66,72.39 73.66,74.93 71.12,77.47 66.04,77.47 PDI_ATMEL.5 66.04,74.93 66.04,72.39 65.83,72.17 R15.2
ADC0
  Bottom 0.254: IC2.5 81.47,45.91 87,51.44 87,60.96 90.17,64.14 94.61,64.14 SV3.3
ADC1
  Bottom 0.254: IC2.6 82.24,45.41 88.27,51.44 88.27,58.42 90.17,60.33 94.61,60.33 SV4.3
ADC2
  Bottom 0.254: IC2.7 83.01,44.91 89.53,51.44 89.53,55.88 90.17,56.52 94.61,56.52 SV9.3
ADC3
  Bottom 0.254: IC2.8 83.78,44.41 91.44,52.07 93.98,52.07 SV10.3
AX12_3V3  (via drill 0.5)
  Top 0.254: v48.9,19.05 48.9,20.95 54.61,26.67 56.52,26.67 57.15,26.67 59.05,28.57 v59.05,30.48 | v61.59,31.75 62.23,31.75 62.87,31.11 80.64,31.11 82.55,33.02 82.55,36.2 v83.19,36.83
  Bottom 0.254: IC5.3 48.02,21.61 R20.2 48.68,19.27 v48.9,19.05 | v59.05,30.48 60.33,31.75 v61.59,31.75 | v83.19,36.83 82.55,36.2 81.92,36.2 80.64,37.47 79.17,37.47 IC2.22 IC2.21
AX12_5V
  Bottom 0.254: IC5.4 44.48,21.61 43.81,20.95 42.33,20.95 41.67,21.61 41.67,19.45 33.02,10.79 17.14,10.79 15.88,9.53 AX12.2
  Bottom 0.406: 41.06,22.23 R17.1 41.67,21.61
AX12_DIR_3V3  (via drill 0.5)
  Top 0.254: v43.18,22.23 49.53,22.23 54.61,27.3 55.88,27.3 56.52,27.3 57.78,28.57 v57.78,30.48 | v61.59,33.02 62.23,33.02 63.5,31.75 80.64,31.75 81.92,33.02 v81.92,37.47
  Bottom 0.254: IC5.5 43.51,22.55 v43.18,22.23 | v57.78,30.48 60.33,33.02 v61.59,33.02 | IC2.20 80.97,38.41 v81.92,37.47
CS_CODEUR_3V3
  Bottom 0.254: IC2.39 70.62,29.34 70.48,29.21 66.67,29.21 62.82,25.36 IC4.16
CS_CODEUR_5V  (via drill 0.5)
  Top 0.254: v57.78,15.24 64.14,8.89 78.11,8.89 81.28,5.71 AEAT_ENCOD.4
  Bottom 0.254: IC4.8 63.47,15.85 61.59,13.97 59.05,13.97 v57.78,15.24
GND  (via drill 0.5, 0.6)
  Top 0.254: v69.22,22.86 69.22,22.74 v67.37,20.89 | v69.22,19.68 70.17,20.64 C24.2 72.71,20.64 74.61,22.54 C23.2 | C20.2 v60.33,21.59 62.87,19.05 C19.2 | IC8.2 80.34,16.18 v80.01,16.51 | C5.2 42.55,40.95 IC1.8 42.55,34.92 v44.45,33.02 48.26,33.02 50.16,31.11 IC1.15 | 50.16,31.75 51.75,33.34 C1.2 53.34,34.92 55.24,36.83 63.04,36.83 IC2.53 63.26,36.91 C14.2 | C7.2 C9.2 73.03,49.22 v73.03,48.26 | C17.1 73.8,58.23 C18.1 74.04,56.89 v73.66,56.52 | SV3.1 91.44,71.44 H3.B3,6 91.48,78.52 L_A3.C L_A2.C L_A1.C L_A0.C 64.55,78.52 | 64.55,78.52 62.87,76.83 62.87,75.56 PDI_ATMEL.6 | 64.55,78.52 COM.C ERROR.C RUN.C | UART_I2C.2 87.27,27.3 86.26,26.29 v86.26,24.56 86.26,23.34 87.4,22.2 89.89,22.2 UART_I2C.6
  Top 0.305: 50.16,31.75 IC1.15
  Top 0.406: PWM_MCC.10 30.48,7.62 30.48,18.29 29.21,19.56 C39.- | R16.1 21.35,25.81 IC6.5
  Top 0.61: R24.1 33.49,48.58 33.93,49.02
  Top 0.813: IC3.1 20.95,75.56 20,74.61 C22.2 C21.2 5.39,74.61 H2.B3,6 3.17,73.17 3.17,60.33 4.04,59.46 ALIM.2 | SV3.1 SV4.1 SV9.1 SV10.1 SV11.1 SV12.1 SV13.1 SV14.1
  Top 1.016: 25.4,29.21 IC6.3 22.1,29.21 21.59,29.72 17.16,29.72 D1.A | 32.03,45.49 33.93,47.4 33.93,49.02 IC7.5 33.96,51.82 35.56,51.82 35.81,52.07 35.81,54.86 35.43,55.24 IC7.3 33.81,55.12 30.73,55.12 29.24,53.63 D2.A | 32.03,45.49 31.75,45.21 27.36,45.21 C40.- 26.86,45.21 25.91,45.21 21.49,40.79 13.82,40.79 9.14,45.47 C41.- 4.57,45.47 2.29,47.75 2.29,57.71 4.04,59.46 | C5.2 41.72,40.13 C42.- 37.8,40.13 | 37.8,40.13 37.39,40.13 32.03,45.49 | 37.8,40.13 34.21,36.55 27.33,36.55 25.87,35.09 25.87,29.68 25.4,29.21 | 25.4,29.21 25.91,28.7 25.91,25.91 25.65,25.65 23.77,25.65 IC6.5 24.44,25.04 C39.- 23.62,19.56 18.29,14.22 8.89,14.22 3.81,19.3 C38.- 2.48,7.52 H4.B3,6
  Bottom 0.254: C28.2 48.78,22.55 IC5.2 46.02,22.55 45.72,22.86 45.72,24.13 46.35,24.77 46.35,26.1 | IC4.11 IC4.12 60.87,21.05 | 60.87,21.05 IC4.13 60.87,22.95 61.59,22.23 66.04,22.23 | IC4.22 66.72,22.91 66.04,22.23 | 66.04,22.23 v67.37,20.89 IC4.2 67.37,15.81 67.94,15.24 69.22,15.24 69.76,15.79 IC9.12 IC9.11 70.41,19.61 71.12,20.32 | 71.12,20.32 75.56,20.32 76.26,19.62 IC9.2 76.26,13.6 79.06,10.79 | IC9.13 69.76,23.41 v69.22,22.86 | 71.12,20.32 69.85,20.32 v69.22,19.68 | v60.33,21.59 60.87,21.05 | SV8.1 74.3,1.91 AEAT_ENCOD.6 76.2,7.62 79.06,10.48 79.06,10.79 | 79.06,10.79 C25.2 C26.2 79.06,16.2 79.38,16.51 v80.01,16.51 | C4.2 v44.45,33.02 41.91,33.02 40.64,31.75 40.64,29.84 42.55,27.94 45.09,27.94 46.54,26.48 C27.2 | v73.03,48.26 73.62,48.85 IC2.93 73.66,49.95 v73.66,56.52 | 96.83,6.83 H1.B3,6 | IC2.73 58.5,46.91 55.24,50.16 UART_CAM.1 | C2.2 87.22,23.6 v86.26,24.56
  Bottom 0.406: 46.35,26.1 C27.2
  Bottom 0.813: C29.2 49.85,1.91 SV2.1 52.39,2.23 C30.2 54.93,1.91 SV1.1 57.47,2.23 C35.2 60.01,1.91 SV6.1 62.55,2.23 C36.2 66.99,2.23 SV7.1 67.63,2.23 C37.2 70.17,1.91 SV8.1 | 5.08,5.08 H4.B3,6 9.45,5 11.43,6.99 17.09,6.99 AX12.1
  Bottom 1.016: PW_BAT.2 18.32,8.84 AX12.1
  other vias: 70.36,36.58 74.68,36.32 76.71,37.85
  pour Top: 64.14,48.9 77.47,48.9 78.11,48.26 78.11,35.56 77.47,34.92 64.77,34.92 64.14,35.56
  pour Top: 118.11,71.75 118.11,84.45 -6.99,84.45 -6.99,-6.35 117.47,-6.35 117.47,71.12 118.11,71.12
  pour Bottom: -3.81,87.63 111.76,87.63 111.76,-13.97 -3.17,-13.97
MC0  (via drill 0.5)
  Top 0.254: v70.48,12.7 65.41,12.7 59.69,18.41 56.52,18.41 46.35,8.26 38.73,8.26 PWM_MCC.7
  Bottom 0.254: IC9.9 71.71,13.93 v70.48,12.7
MC0_3V3
  Bottom 0.254: IC2.30 75.12,29.4 71.06,25.34 IC9.15
MC1
  Bottom 0.254: IC4.3 66.72,12.74 64.77,10.79 48.9,10.79 45.72,7.62 45.72,5.08 PWM_MCC.2
MC1_3V3
  Bottom 0.254: IC2.32 74.12,29.67 70.48,26.04 66.67,26.04 66.07,25.43 IC4.21
MC2
  Bottom 0.254: IC4.5 65.42,13.98 63.5,12.06 47.62,12.06 43.18,7.62 43.18,5.08 PWM_MCC.4
MC2_3V3
  Bottom 0.254: IC4.19 64.77,25.4 66.67,27.3 70.48,27.3 72.12,28.94 IC2.36
MC3
  Bottom 0.254: IC4.7 64.12,15.22 62.23,13.34 46.35,13.34 40.64,7.62 40.64,5.08 PWM_MCC.6
MC3_3V3
  Bottom 0.254: IC4.17 63.47,25.37 66.67,28.57 70.48,28.57 71.12,29.21 IC2.38
MISO_CODEUR_3V3  (via drill 0.5)
  Top 0.254: v77.47,14.61 IC8.3 | v79.38,20.32 79.38,26.67 78.11,27.94 63.5,27.94 v62.23,26.67
  Bottom 0.254: v79.38,20.32 79.38,18.41 77.47,16.51 v77.47,14.61 | IC2.41 69.62,30.89 69.22,30.48 66.67,30.48 62.87,26.67 v62.23,26.67
MISO_CODEUR_5V
  Top 0.254: IC8.4 79.4,11.4 80.01,10.79 80.64,10.79 85.09,6.35 86.36,6.35 AEAT_ENCOD.1
MOSI_CODEUR_3V3
  Bottom 0.254: IC4.15 62.17,25.34 66.67,29.84 69.85,29.84 70.12,30.11 IC2.40
MOSI_CODEUR_5V  (via drill 0.5)
  Top 0.254: v57.78,16.51 64.77,9.53 78.74,9.53 83.82,4.45 AEAT_ENCOD.3
  Bottom 0.254: IC4.9 62.82,16.46 60.96,14.61 59.69,14.61 v57.78,16.51
N$1
  Top 0.254: C3.1 51.44,40.95 IC1.1
N$2
  Top 0.254: RUN.A R9.2
N$3
  Top 0.61: IC7.4 32.97,53.54 31.5,52.07 31.5,50.73 R24.2 R25.1
N$4
  Top 0.254: R10.2 ERROR.A
N$5
  Top 0.254: C3.2 48.9,40.95 IC1.3
N$6
  Top 0.254: C6.1 47.62,38.42 IC1.4
N$7
  Top 0.254: COM.A R11.2
N$8
  Top 0.61: IC6.4 21.35,27.51 R16.2 19.77,27.9 18.03,26.16 16.73,26.16 R12.1
N$9  (via drill 0.5)
  Top 0.254: v50.16,69.85 R9.1
  Bottom 0.254: IC2.75 63.12,56.9 v50.16,69.85
N$10  (via drill 0.5)
  Top 0.254: v53.98,69.85 R10.1
  Bottom 0.254: IC2.76 65.12,58.7 v53.98,69.85
N$11  (via drill 0.5)
  Top 0.254: v49.53,33.02 50.16,33.66 IC1.2
  Bottom 0.254: C4.1 v49.53,33.02
N$12  (via drill 0.5)
  Top 0.254: v57.78,69.85 R11.1
  Bottom 0.254: IC2.77 65.62,62.02 v57.78,69.85
N$13
  Top 0.254: C5.1 45.09,40.95 IC1.6
N$15
  Top 1.016: R23.1 26.71,8.98 PW_BAT.1
N$16
  Top 1.016: IC6.2 22.43,30.91 17.53,35.81 17.27,36.21 D1.C 7.26,36.72 L1.2
N$17
  Top 1.016: IC7.2 30.34,56.95 D2.C 25.24,62.05 L2.2
N$24
  Top 0.254: C6.2 46.35,38.42 IC1.5
N$45  (via drill 0.5)
  Top 0.254: C17.2 67.82,56.52 Q1.2 68.5,53.34 v71.12,53.34
  Bottom 0.254: IC2.91 72.62,51.84 v71.12,53.34
N$46  (via drill 0.5)
  Top 0.254: C18.2 77.47,56.93 Q1.1 76.8,53.34 v72.39,53.34
  Bottom 0.254: IC2.92 73.12,52.61 v72.39,53.34
N$91
  Top 0.254: R5.2 L_A0.A
N$92
  Top 0.254: L_A1.A R6.2
N$93
  Top 0.254: R7.2 L_A2.A
N$94
  Top 0.254: R8.2 L_A3.A
PA0  (via drill 0.6)
  Top 0.305: v77.47,69.85 R5.1
  Bottom 0.305: IC2.95 74.62,54.94 77.47,57.78 v77.47,69.85
PA1  (via drill 0.5)
  Top 0.254: v81.28,69.85 R6.1
  Bottom 0.254: IC2.96 75.12,51.62
  Bottom 0.305: 75.12,51.62 75.12,54.16 81.28,60.33 v81.28,69.85
PA2  (via drill 0.5)
  Top 0.254: v85.09,69.85 R7.1
  Bottom 0.254: IC2.97 75.62,51.49
  Bottom 0.305: 75.62,51.49 75.62,53.4 85.09,62.87 v85.09,69.85
PA3  (via drill 0.5)
  Top 0.254: v88.9,69.85 R8.1
  Bottom 0.254: IC2.98 76.12,51.35
  Bottom 0.305: 76.12,51.35 76.12,52.62 88.9,65.41 v88.9,69.85
PC0
  Bottom 0.254: IC2.15 87.9,40.91 90.17,43.18 90.17,45.72 90.81,46.35 94.61,46.35 SV11.3
PC1
  Bottom 0.254: IC2.16 88.03,40.41 90.17,42.55 94.61,42.55 SV12.3
PC2
  Bottom 0.254: IC2.17 89,39.91 90.17,38.73 94.61,38.73 SV13.3
PC3
  Bottom 0.254: IC2.18 88.86,39.41 90.17,38.1 90.17,35.56 90.81,34.92 94.61,34.92 SV14.3
PDI_DATA_3V3
  Bottom 0.254: IC2.89 71.62,50.94 69.22,53.34 69.22,70.48 71.12,72.39 71.12,74.93 PDI_ATMEL.1
PW  (via drill 1)
  Top 1.016: IC6.1 23.67,35.36 28.19,39.88 29.91,39.88 C42.+ v33.66,40.13 | v39.5,63.78 39.51,63.8 C43.+ 39.31,66.19 38,66.19 33.93,62.13 IC7.1 | R23.2 28.61,16.7 v28.68,16.76
  Bottom 1.016: v39.5,63.78 33.73,58.01 33.73,40.21 v33.66,40.13 | R21.2 29.58,40.13 v33.66,40.13 | v33.66,40.13 33.66,38.81 30.2,35.36 30.2,18.29 v28.68,16.76
PWM0
  Bottom 0.254: IC9.3 75.61,10.21 SV8.3
PWM0_3V3  (via drill 0.5)
  Top 0.254: v78.74,33.66 80.01,33.66 v80.64,33.02
  Bottom 0.254: IC9.21 74.96,25.43 78.74,29.21 78.74,31.11 v80.64,33.02 | IC2.25 79.12,34.03 v78.74,33.66
PWM1
  Bottom 0.254: IC9.4 74.96,10.82 72.39,8.26 68.58,8.26 SV7.3
PWM1_3V3
  Bottom 0.254: IC9.20 74.31,25.41 78.11,29.21 78.11,31.75 81.28,34.92 84.45,34.92 85.09,35.56 85.09,38.1 84.28,38.91 IC2.19
PWM2
  Bottom 0.254: IC9.5 74.31,11.45 71.75,8.89 64.14,8.89 SV6.3
PWM2_3V3
  Bottom 0.254: IC2.26 77.12,28.86 73.66,25.4 IC9.19
PWM3
  Bottom 0.254: IC9.6 73.66,12.06 71.12,9.53 59.69,9.53 SV1.3
PWM3_3V3
  Bottom 0.254: IC2.27 76.62,29 73.03,25.4 73.03,24.2 IC9.18
PWM4
  Bottom 0.254: IC9.7 73.01,12.69 70.48,10.16 55.24,10.16 SV2.3
PWM4_3V3
  Bottom 0.254: IC2.28 76.12,29.13 72.36,25.37 IC9.17
RX_3V3  (via drill 0.5)
  Top 0.254: IC1.12 46.35,29.21 48.26,27.3 v48.26,26.67 46.04,26.67 R13.2
  Bottom 0.254: IC2.47 66.62,32.97 63.5,29.84 60.96,29.84 59.69,28.57 57.15,28.57 | 57.15,28.57 55.88,29.84 51.44,29.84 v48.26,26.67 | R3.1 57.15,28.57
RX_232  (via drill 0.5)
  Top 0.254: IC1.13 47.62,28.57 50.16,26.04 | 50.16,26.04 52.7,26.04 55.24,28.57 v55.88,28.57 | v53.34,28.57 53.98,28.57 57.78,32.38 59.69,32.38 61.59,30.48 78.11,30.48 79.38,29.21 92.08,29.21 92.71,28.57 92.71,25.91 91.95,25.15 90.3,25.15 UART_I2C.4 | R13.1 48.58,24.45 50.16,26.04
  Bottom 0.254: v53.34,28.57 v55.88,28.57
RX_CAM_3V3
  Bottom 0.254: IC2.51 58.07,35.91 52.7,41.27 UART_CAM.2
  Bottom 0.406: UART_CAM.2 R18.1
SCK_CODEUR_3V3
  Bottom 0.254: IC2.42 69.12,31.66 68.58,31.11 66.67,31.11 63.5,27.94 62.23,27.94 61.52,27.23 IC4.14
SCK_CODEUR_5V  (via drill 0.5)
  Top 0.254: v59.69,15.88 65.41,10.16 80.01,10.16 AEAT_ENCOD.2
  Bottom 0.254: IC4.10 62.17,17.09 60.96,15.88 v59.69,15.88
SCL_3V3  (via drill 0.5, 0.6)
  Top 0.254: v59.05,26.04 59.05,26.67 61.59,29.21 78.11,29.21 85.22,22.1 v86.11,22.1 | UART_I2C.7 95.63,20.83 v94.11,20.83
  Bottom 0.254: IC2.46 67.12,32.83 63.5,29.21 61.59,29.21 59.05,26.67 v59.05,26.04 | v86.11,22.1 85.89,21.8 R2.1 91.53,20.95 94.11,20.95 v94.11,20.83
SDA_3V3  (via drill 0.5)
  Top 0.254: v60.33,26.04 62.87,28.57 78.11,28.57 87,19.68 88.27,19.68 UART_I2C.8
  Top 0.406: 88.27,19.68 88.27,16.8 R1.1
  Bottom 0.254: IC2.45 67.62,32.7 63.5,28.57 62.23,28.57 60.33,26.67 v60.33,26.04
SENS0  (via drill 0.5)
  Top 0.254: v70.48,11.43 65.41,11.43 59.05,17.78 57.15,17.78 46.99,7.62 40.64,7.62 PWM_MCC.5
  Bottom 0.254: IC9.8 72.36,13.3 v70.48,11.43
SENS0_3V3
  Bottom 0.254: IC2.29 75.62,29.27 71.71,25.36 IC9.16
SENS1  (via drill 0.5)
  Top 0.254: v70.48,13.97 65.41,13.97 60.33,19.05 55.88,19.05 45.72,8.89 37.47,8.89 35.56,6.99 35.56,5.08 PWM_MCC.8
  Bottom 0.254: IC9.10 71.06,14.54 v70.48,13.97
SENS1_3V3
  Bottom 0.254: IC2.31 74.62,29.54 70.41,25.32 IC9.14
SENS2
  Bottom 0.254: IC4.4 66.07,13.37 64.14,11.43 48.26,11.43 44.45,7.62 PWM_MCC.1
SENS2_3V3
  Bottom 0.254: IC2.35 72.62,28.8 70.48,26.67 66.67,26.67 65.42,25.41 IC4.20
SENS3
  Bottom 0.254: IC4.6 64.77,14.61 62.87,12.7 46.99,12.7 41.91,7.62 PWM_MCC.3
SENS3_3V3
  Bottom 0.254: IC2.37 71.62,29.07 70.48,27.94 66.67,27.94 64.14,25.4 64.14,24.2 IC4.18
TX_3V3  (via drill 0.5)
  Top 0.254: IC1.10 IC1.11 45.09,28.57 45.72,27.94 | v46.35,27.94 45.72,27.94 | 45.72,27.94 44.77,27.94 R14.2
  Bottom 0.2: 66.12,33.1 63.5,30.48
  Bottom 0.254: IC2.48 66.12,33.1 | 63.5,30.48 60.96,30.48 59.69,29.21 57.15,29.21 55.88,30.48 | 55.88,30.48 48.9,30.48 v46.35,27.94 | R4.1 55.24,31.11 55.88,30.48
TX_232  (via drill 0.6)
  Top 0.254: R14.1 42.87,24.77 41.91,24.77 41.27,25.4 41.27,31.11 41.91,31.75 48.26,31.75 48.9,31.11 IC1.14 48.9,28.57 50.8,26.67 52.7,26.67 57.78,31.75 59.69,31.75 61.59,29.84 78.11,29.84 79.38,28.57 85.22,28.57 v85.85,27.94 | UART_I2C.3 96.14,26.04 96.27,26.16 95.63,26.16 UART_I2C.3
  Bottom 0.254: v85.85,27.94 93.6,27.94 UART_I2C.3
  other vias: 95.5,26.04
TX_CAM_3V3  (via drill 0.5)
  Top 0.254: v53.98,41.91 50.16,45.72 UART_CAM.3
  Bottom 0.254: IC2.52 59.48,36.41 v53.98,41.91
  Bottom 0.406: UART_CAM.3 R19.1

### Text on the board
tNames: servo analogique